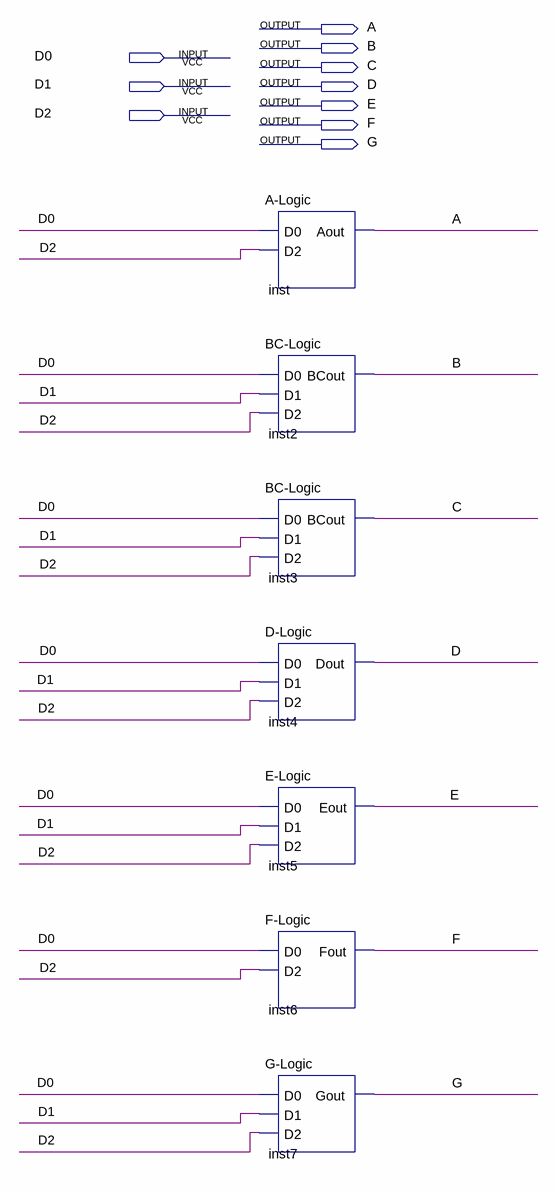
[diagram p0: schematic sheet]
// Quartus schematic MesageDecoder.bdf as structural Verilog: 7 symbols, 10 pins
module MesageDecoder (
  input  D0,
  input  D1,
  input  D2,
  output A,
  output B,
  output C,
  output D,
  output E,
  output F,
  output G
);

  \A-Logic  inst (.D0(D0), .D2(D2), .Aout(A));
  \BC-Logic  inst2 (.D0(D0), .D1(D1), .D2(D2), .BCout(B));
  \BC-Logic  inst3 (.D0(D0), .D1(D1), .D2(D2), .BCout(C));
  \D-Logic  inst4 (.D0(D0), .D1(D1), .D2(D2), .Dout(D));
  \E-Logic  inst5 (.D0(D0), .D1(D1), .D2(D2), .Eout(E));
  \F-Logic  inst6 (.D0(D0), .D2(D2), .Fout(F));
  \G-Logic  inst7 (.D0(D0), .D1(D1), .D2(D2), .Gout(G));
endmodule
